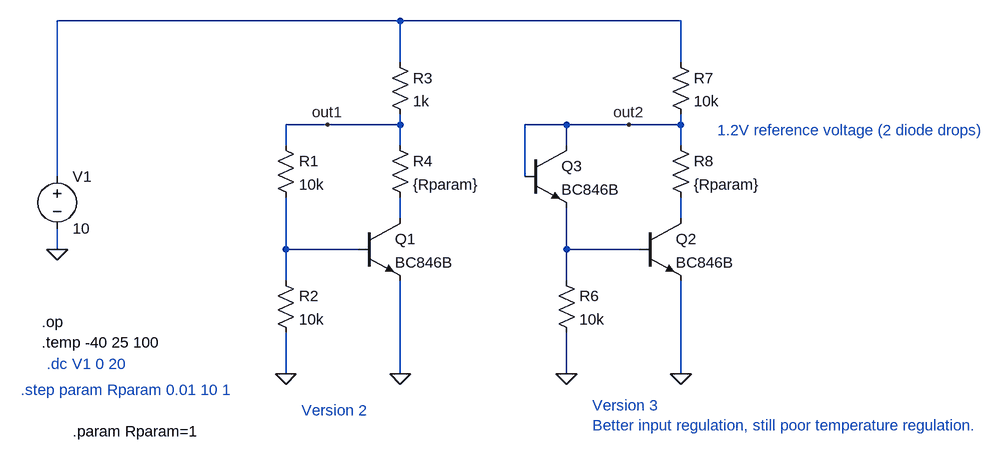
[diagram p0: schematic voltage_reference2.asc]
voltage_reference2.asc, the LTspice schematic file:
Version 4
SHEET 1 1264 680
WIRE 304 -144 -224 -144
WIRE 736 -144 304 -144
WIRE 304 -80 304 -144
WIRE 736 -80 736 -144
WIRE 192 16 128 16
WIRE 304 16 304 0
WIRE 304 16 192 16
WIRE 560 16 496 16
WIRE 656 16 560 16
WIRE 736 16 736 0
WIRE 736 16 656 16
WIRE 128 48 128 16
WIRE 304 48 304 16
WIRE 560 48 560 16
WIRE 736 48 736 16
WIRE -224 96 -224 -144
WIRE 496 96 496 16
WIRE 304 160 304 128
WIRE 736 160 736 128
WIRE -224 208 -224 176
WIRE 128 208 128 128
WIRE 240 208 128 208
WIRE 560 208 560 144
WIRE 672 208 560 208
WIRE 128 256 128 208
WIRE 560 256 560 208
WIRE 128 400 128 336
WIRE 304 400 304 256
WIRE 560 400 560 336
WIRE 736 400 736 256
FLAG -224 208 0
FLAG 128 400 0
FLAG 304 400 0
FLAG 560 400 0
FLAG 736 400 0
FLAG 192 16 out1
FLAG 656 16 out2
SYMBOL voltage -224 80 R0
WINDOW 123 0 0 Left 0
WINDOW 39 0 0 Left 0
SYMATTR InstName V1
SYMATTR Value 10
SYMBOL npn 240 160 R0
SYMATTR InstName Q1
SYMATTR Value BC846B
SYMBOL res 112 32 R0
SYMATTR InstName R1
SYMATTR Value 10k
SYMBOL res 112 240 R0
SYMATTR InstName R2
SYMATTR Value 10k
SYMBOL res 288 -96 R0
SYMATTR InstName R3
SYMATTR Value 1k
SYMBOL res 288 32 R0
SYMATTR InstName R4
SYMATTR Value {Rparam}
SYMBOL npn 672 160 R0
SYMATTR InstName Q2
SYMATTR Value BC846B
SYMBOL res 544 240 R0
SYMATTR InstName R6
SYMATTR Value 10k
SYMBOL res 720 -96 R0
SYMATTR InstName R7
SYMATTR Value 10k
SYMBOL res 720 32 R0
SYMATTR InstName R8
SYMATTR Value {Rparam}
SYMBOL npn 496 48 R0
SYMATTR InstName Q3
SYMATTR Value BC846B
TEXT -240 384 Left 2 ;.dc V1 0 20
TEXT -280 424 Left 2 ;.step param Rparam 0.01 10 1
TEXT 152 456 Left 2 ;Version 2
TEXT 600 448 Left 2 ;Version 3\nBetter input regulation, still poor temperature regulation.
TEXT 792 24 Left 2 ;1.2V reference voltage (2 diode drops)
TEXT -200 488 Left 2 !.param Rparam=1
TEXT -248 320 Left 2 !.op\n.temp -40 25 100

The netlist it stands for:
* voltage_reference2.asc
V1 N001 0 10
Q1 N002 N004 0 0 BC846B
R1 out1 N004 10k
R2 N004 0 10k
R3 N001 out1 1k
R4 out1 N002 {Rparam}
Q2 N003 N005 0 0 BC846B
R6 N005 0 10k
R7 N001 out2 10k
R8 out2 N003 {Rparam}
Q3 out2 out2 N005 0 BC846B
.model NPN NPN
.model PNP PNP
.lib standard.bjt
* .dc V1 0 20
* .step param Rparam 0.01 10 1
* Version 2
* Version 3
* Better input regulation, still poor temperature regulation.
* 1.2V reference voltage (2 diode drops)
.param Rparam=1
.op
.temp -40 25 100
.backanno
.end